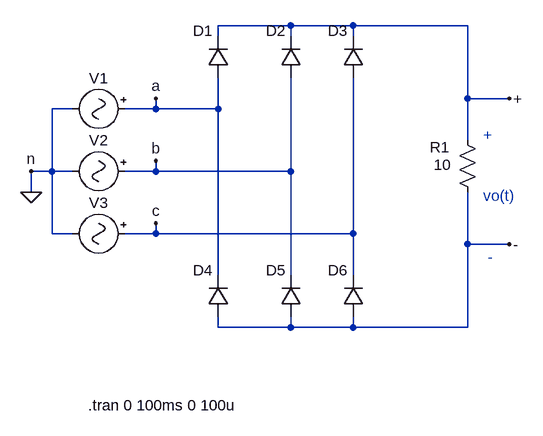
[diagram p0: schematic LTSpice Model of 3 Phase Rectifier.asc]
LTSpice Model of 3 Phase Rectifier.asc, the LTspice schematic file:
Version 4
SHEET 1 880 680
WIRE 240 32 128 32
WIRE 336 32 240 32
WIRE 512 32 336 32
WIRE 128 48 128 32
WIRE 240 48 240 32
WIRE 336 48 336 32
WIRE 512 144 512 32
WIRE 576 144 512 144
WIRE -96 160 -128 160
WIRE 32 160 32 144
WIRE 32 160 -16 160
WIRE 128 160 128 112
WIRE 128 160 32 160
WIRE 512 208 512 144
WIRE -128 256 -128 160
WIRE -128 256 -160 256
WIRE -96 256 -128 256
WIRE 32 256 32 240
WIRE 32 256 -16 256
WIRE 240 256 240 112
WIRE 240 256 32 256
WIRE -160 288 -160 256
WIRE -128 352 -128 256
WIRE -96 352 -128 352
WIRE 32 352 32 336
WIRE 32 352 -16 352
WIRE 336 352 336 112
WIRE 336 352 32 352
WIRE 512 368 512 288
WIRE 576 368 512 368
WIRE 128 416 128 160
WIRE 240 416 240 256
WIRE 336 416 336 352
WIRE 128 496 128 480
WIRE 240 496 240 480
WIRE 240 496 128 496
WIRE 336 496 336 480
WIRE 336 496 240 496
WIRE 512 496 512 368
WIRE 512 496 336 496
FLAG -160 288 0
FLAG -160 256 n
FLAG 32 144 a
FLAG 32 240 b
FLAG 32 336 c
FLAG 576 144 +
FLAG 576 368 -
SYMBOL Misc\\signal 0 160 R90
WINDOW 0 -32 56 VBottom 0
WINDOW 3 32 56 Invisible 0
WINDOW 123 0 0 Left 0
WINDOW 39 0 0 Left 0
SYMATTR InstName V1
SYMATTR Value SINE(0 100 50)
SYMBOL Misc\\signal 0 256 R90
WINDOW 0 -32 56 VBottom 0
WINDOW 3 32 56 Invisible 0
WINDOW 123 0 0 Left 0
WINDOW 39 0 0 Left 0
SYMATTR InstName V2
SYMATTR Value SINE(0 100 50 0 0 -120)
SYMBOL Misc\\signal 0 352 R90
WINDOW 0 -32 56 VBottom 0
WINDOW 3 32 56 Invisible 0
WINDOW 123 0 0 Left 0
WINDOW 39 0 0 Left 0
SYMATTR InstName V3
SYMATTR Value SINE(0 100 50 0 0 -240)
SYMBOL diode 144 112 R180
WINDOW 0 24 72 Left 0
WINDOW 3 24 0 Invisible 0
SYMATTR InstName D1
SYMBOL diode 256 112 R180
WINDOW 0 24 72 Left 0
WINDOW 3 24 0 Invisible 0
SYMATTR InstName D2
SYMBOL diode 352 112 R180
WINDOW 0 24 72 Left 0
WINDOW 3 24 0 Invisible 0
SYMATTR InstName D3
SYMBOL diode 144 480 R180
WINDOW 0 24 72 Left 0
WINDOW 3 24 0 Invisible 0
SYMATTR InstName D4
SYMBOL diode 256 480 R180
WINDOW 0 24 72 Left 0
WINDOW 3 24 0 Invisible 0
SYMATTR InstName D5
SYMBOL diode 352 480 R180
WINDOW 0 24 72 Left 0
WINDOW 3 24 0 Invisible 0
SYMATTR InstName D6
SYMBOL res 496 192 R0
WINDOW 0 -42 27 Left 0
WINDOW 3 -36 54 Left 0
SYMATTR InstName R1
SYMATTR Value 10
TEXT -72 616 Left 0 !.tran 0 100ms 0 100u
TEXT 536 200 Left 0 ;+\n \n\nvo(t)\n \n\n -

The netlist it stands for:
* LTSpice Model of 3 Phase Rectifier.asc
V1 a 0 SINE(0 100 50)
V2 b 0 SINE(0 100 50 0 0 -120)
V3 c 0 SINE(0 100 50 0 0 -240)
D1 a + D
D2 b + D
D3 c + D
D4 - a D
D5 - b D
D6 - c D
R1 + - 10
.model D D
.lib standard.dio
.tran 0 100ms 0 100u
* +
* vo(t)
*  -
.backanno
.end